# EasyEDA schematic PCB_capolavoro.json
TITLE: Sheet_1; REV: 1.0; Date: 2024-05-17; Sheet: 1/1; Drawn By: matteopoli1; Company: Your Company
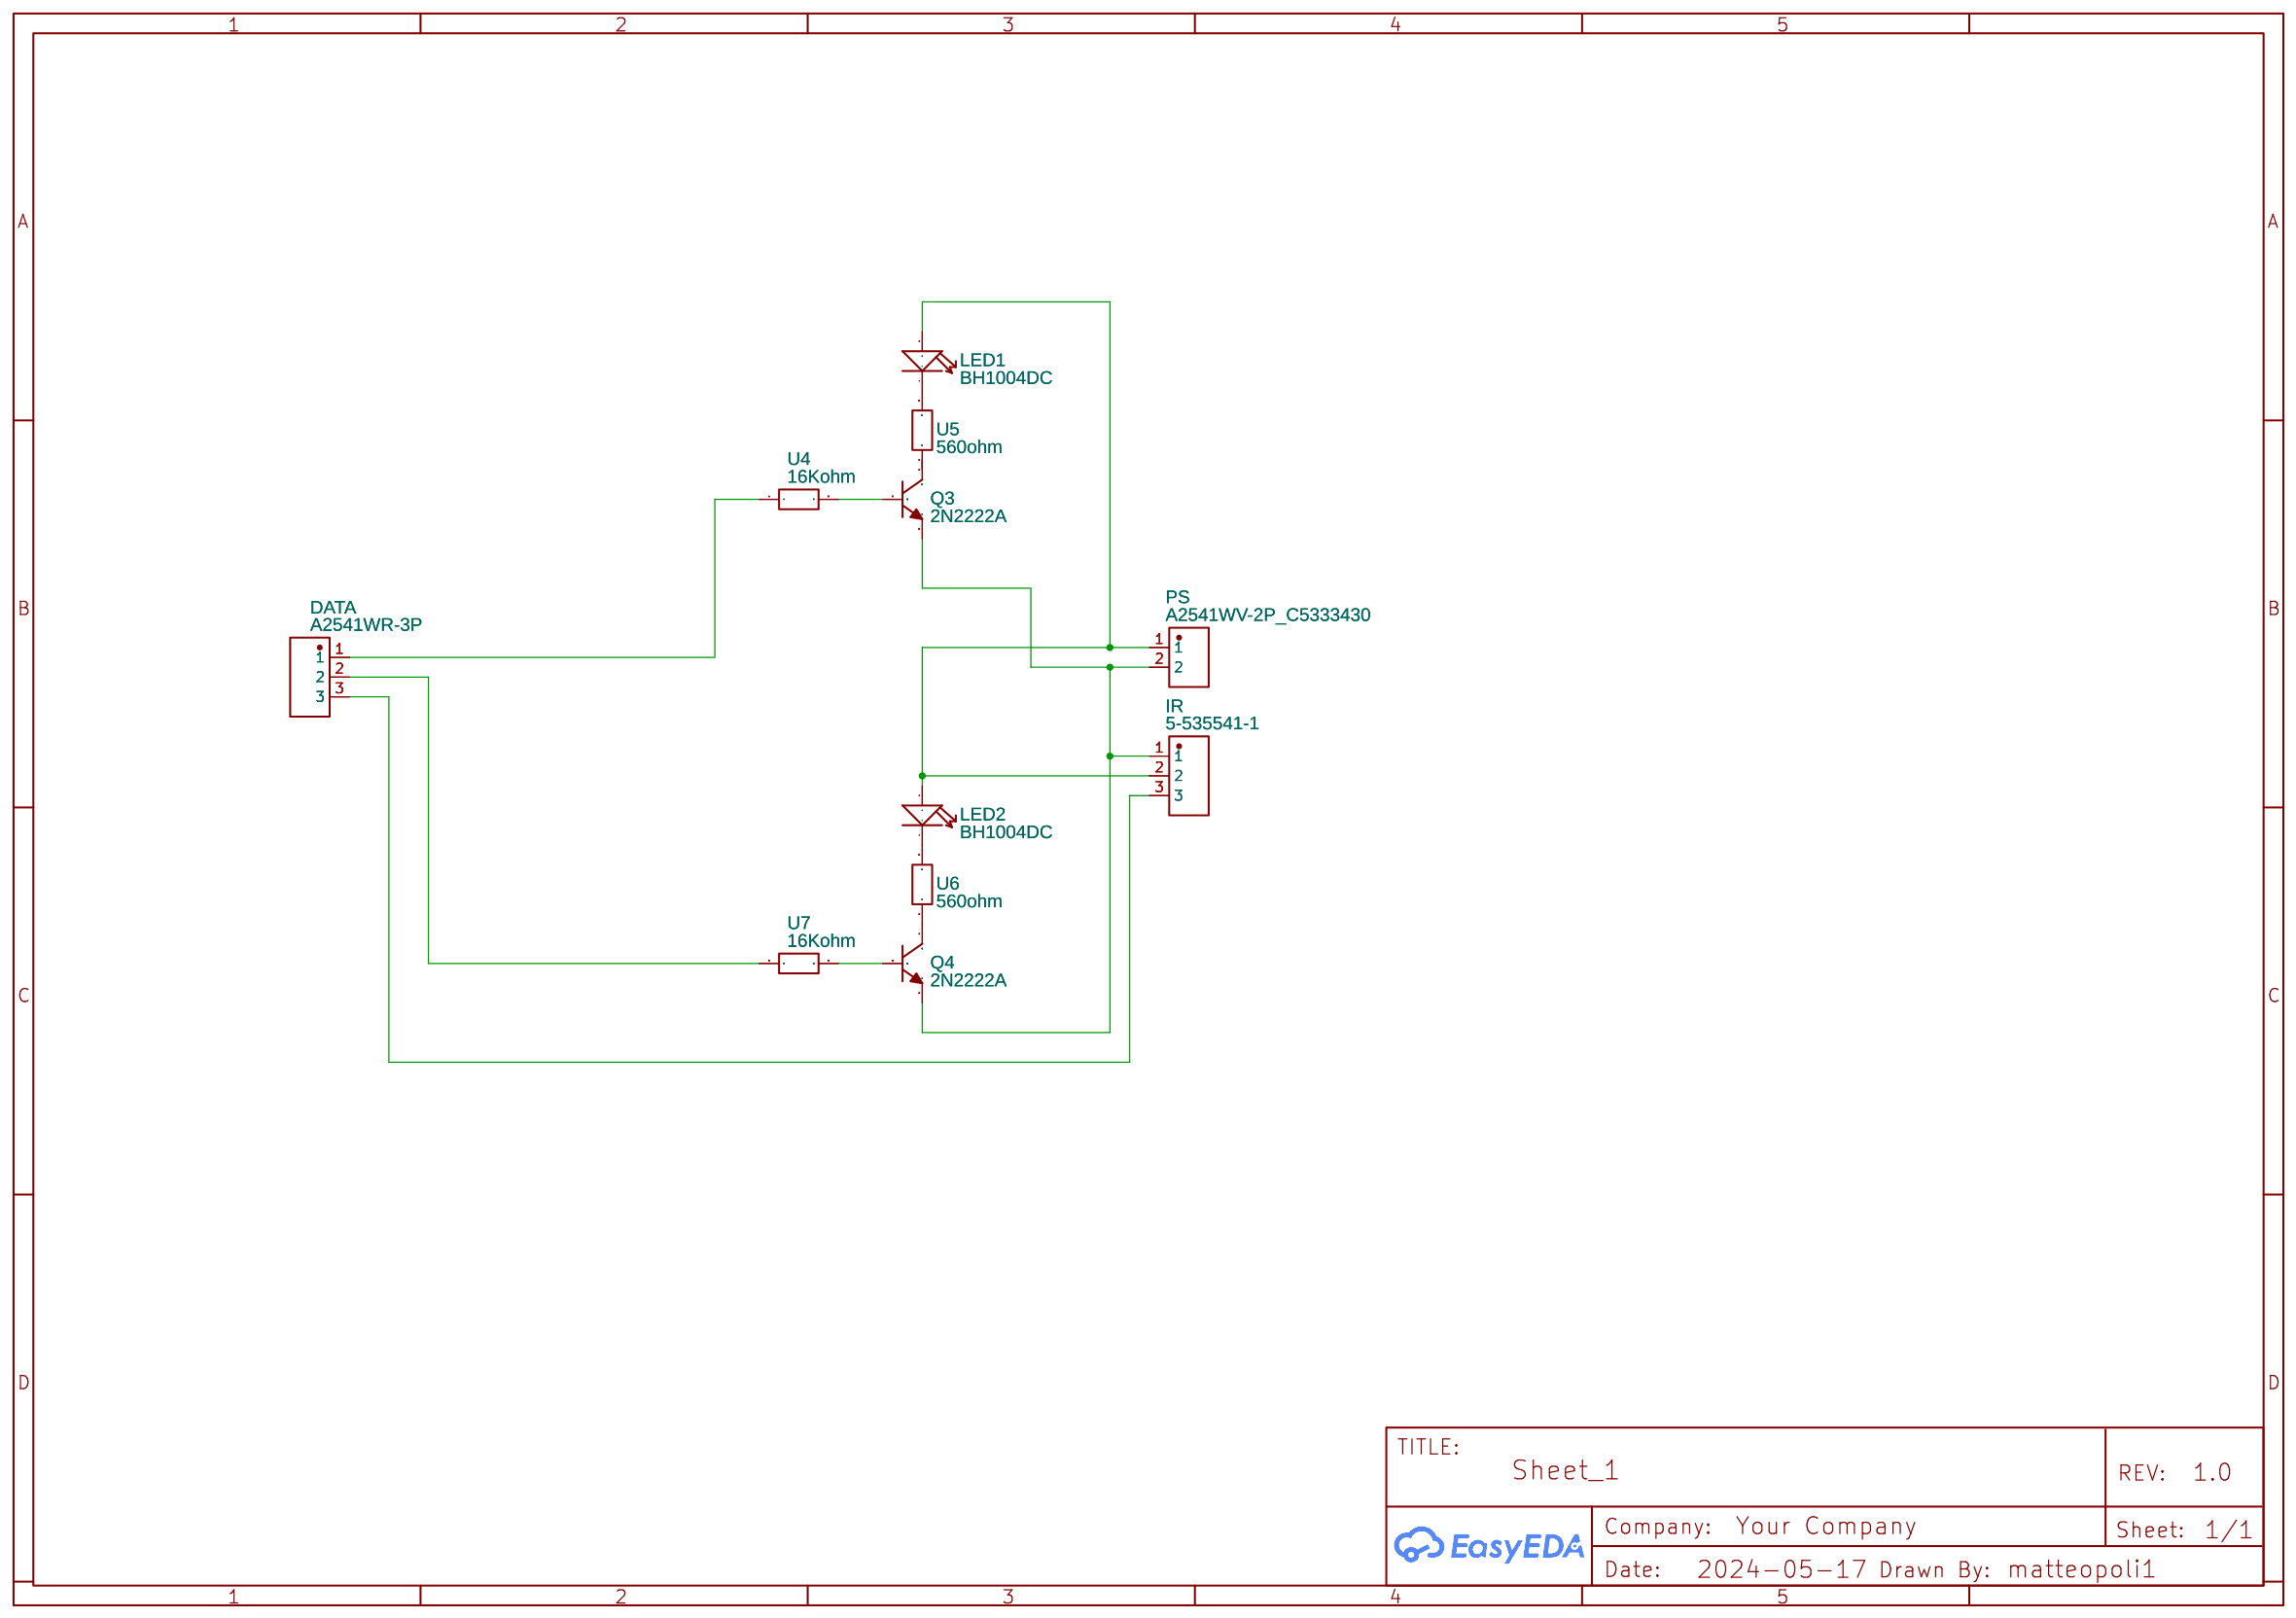
[diagram p0: schematic sheet]

## Parts
DATA  A2541WR-3P  [HDR-TH_3P-P2.54-H-M-W10.0]
IR  5-535541-1  [HDR-TH_3P-P2.54-V-F]
LED1  BH1004DC  [LED2-2.54-D10MM]
LED2  BH1004DC  [LED2-2.54-D10MM]
PS  A2541WV-2P_C5333430  [HDR-TH_P2.54-H-M_A2541WV-2P]
Q3  2N2222A  [TO-92-3_L4.8-W3.7-P2.54-R]
Q4  2N2222A  [TO-92-3_L4.8-W3.7-P2.54-R]
U4  16Kohm  [RES-TH_BD3.8-L10.3-P14.30-D0.7]
U5  560ohm  [RES-TH_BD3.8-L10.3-P14.30-D0.7]
U6  560ohm  [RES-TH_BD3.8-L10.3-P14.30-D0.7]
U7  16Kohm  [RES-TH_BD3.8-L10.3-P14.30-D0.7]

## Library data of the parts
DATA = A2541WR-3P: Contributor: LCSC; Supplier: LCSC; Supplier Part: C225489; Manufacturer: CJT(长江连接器); JLCPCB Part Class: Extended Part
IR = 5-535541-1: Supplier: LCSC; Supplier Part: C6688901; Manufacturer: TE Connectivity(泰科电子); Contributor: lcsc; JLCPCB Part Class: Extended Part
LED1 LED2 = BH1004DC: DIP LED Blue-Blue-10mm;
PS = A2541WV-2P_C5333430: Contributor: lcsc; Supplier: LCSC; Supplier Part: C5333430; Manufacturer: CJT(长江连接器); Manufacturer Part: A2541WV-2P; JLCPCB Part Class: Extended Part
Q3 Q4 = 2N2222A: Contributor: LCSC; Supplier: LCSC; Supplier Part: C358533; Manufacturer: BLUE ROCKET(蓝箭); JLCPCB Part Class: Extended Part
U4-U7 = OF434JE: Contributor: lcsc; Supplier: LCSC; Supplier Part: C3534093; Manufacturer: Ohmite; JLCPCB Part Class: Extended Part

## Nets
Net-(DATA-1): DATA.1 U4.1
Net-(DATA-2): DATA.2 U7.1
Net-(DATA-3): DATA.3 IR.3
Net-(IR-1): IR.1 PS.2 Q3.3(E) Q4.3(E)
Net-(IR-2): IR.2 LED1.+ LED2.+ PS.1
Net-(LED1--): LED1.- U5.2
Net-(LED2--): LED2.- U6.2
Net-(Q3-1): Q3.1(C) U5.1
Net-(Q3-2): Q3.2(B) U4.2
Net-(Q4-1): Q4.1(C) U6.1
Net-(Q4-2): Q4.2(B) U7.2
